# Altium schematic sheet Sheet1.SchDoc
size A
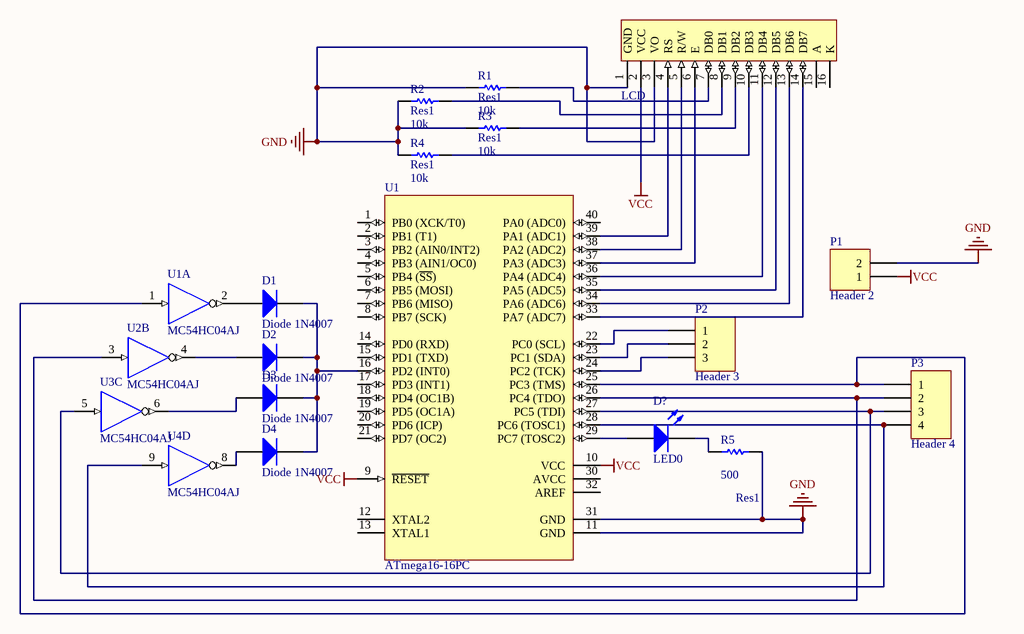
[diagram p0: Sheet1.SchDoc]

## Parts
(Parts that share a designator on the sheet are numbered #1, #2 ... from top to bottom, then left to right.)
D1  Diode 1N4007  [DO-41]
D2  Diode 1N4007  [DO-41]
D3  Diode 1N4007  [DO-41]
D4  Diode 1N4007  [DO-41]
D?  LED0  [LED-0]
LCD  LCD 16X2  [My_LCD 16x2-A]  (value not drawn)
P1  Header 2  [HDR1X2]
P2  Header 3  [HDR1X3]
P3  Header 4  [HDR1X4]
R1  Res1  value 10k  [AXIAL-0.3]
R2  Res1  value 10k  [AXIAL-0.3]
R3  Res1  value 10k  [AXIAL-0.3]
R4  Res1  value 10k  [AXIAL-0.3]
R5  Res1  value 500  [AXIAL-0.3]
U1#1  ATmega16-16PC  [40P6]
U1#2  MC54HC04AJ  [632-08]  (part A of 6)
U2  MC54HC04AJ  [632-08]  (part B of 6)
U3  MC54HC04AJ  [632-08]  (part C of 6)
U4  MC54HC04AJ  [632-08]  (part D of 6)

## Nets
GND: LCD.1(GND) LCD.3(VO) P1.2 R1.1 R2.1 R3.1 R4.1 R5.2 U1#1.11(GND) U1#1.31(GND) U1#2.7(GND) U2.7(GND) U3.7(GND) U4.7(GND)
VCC: LCD.2(VCC) P1.1 U1#1.9(~{RESET}) U1#1.10(VCC)
VDD: U1#2.14(VDD) U2.14(VDD) U3.14(VDD) U4.14(VDD)
NetD1_1: D1.1(A) U1#2.2(Y)
NetD1_2: D1.2(K) D2.2(K) D3.2(K) D4.2(K) U1#1.16(PD2_(INT0))
NetD2_1: D2.1(A) U2.4(Y)
NetD3_1: D3.1(A) U3.6(Y)
NetD4_1: D4.1(A) U4.8(Y)
NetD?_1: D?.1(A) U1#1.29(PC7_(TOSC2))
NetD?_2: D?.2(K) R5.1
NetLCD_4: LCD.4(RS) U1#1.39(PA1_(ADC1))
NetLCD_5: LCD.5(R/W) U1#1.38(PA2_(ADC2))
NetLCD_6: LCD.6(E) U1#1.37(PA3_(ADC3))
NetLCD_7: LCD.7(DB0) R1.2
NetLCD_8: LCD.8(DB1) R2.2
NetLCD_9: LCD.9(DB2) R3.2
NetLCD_10: LCD.10(DB3) R4.2
NetLCD_11: LCD.11(DB4) U1#1.36(PA4_(ADC4))
NetLCD_12: LCD.12(DB5) U1#1.35(PA5_(ADC5))
NetLCD_13: LCD.13(DB6) U1#1.34(PA6_(ADC6))
NetLCD_14: LCD.14(DB7) U1#1.33(PA7_(ADC7))
NetP2_1: P2.1 U1#1.22(PC0_(SCL))
NetP2_2: P2.2 U1#1.23(PC1_(SDA))
NetP2_3: P2.3 U1#1.24(PC2_(TCK))
NetP3_1: P3.1 U1#1.25(PC3_(TMS)) U1#2.1(A)
NetP3_2: P3.2 U1#1.26(PC4_(TDO)) U2.3(A)
NetP3_3: P3.3 U1#1.27(PC5_(TDI)) U3.5(A)
NetP3_4: P3.4 U1#1.28(PC6_(TOSC1)) U4.9(A)

Not connected (* = marked no-connect by the designer): LCD 15(A) 16(K); U1#1 1(PB0_(XCK/T0)) 2(PB1_(T1)) 3(PB2_(AIN0/INT2)) 4(PB3_(AIN1/OC0)) 5(PB4_(~{SS})) 6(PB5_(MOSI)) 7(PB6_(MISO)) 8(PB7_(SCK)) 12(XTAL2) 13(XTAL1) 14(PD0_(RXD)) 15(PD1_(TXD)) 17(PD3_(INT1)) 18(PD4_(OC1B)) 19(PD5_(OC1A)) 20(PD6_(ICP)) 21(PD7_(OC2)) 30(AVCC) 32(AREF) 40(PA0_(ADC0))

## Library data of the parts
D1-D4 = Diode 1N4007: 1 Amp General Purpose Rectifier; Published: 8-Jun-2000; LatestRevisionDate: 17-Jul-2002; LatestRevisionNote: Re-released for DXP Platform.; DatasheetVersion: 1998; PackageVersion: Aug-1999; PackageReference: DO-41; Publisher: Altium Limited; PackageDescription: Diode, Axial; Body 5.2 x 2.7 mm (LxDia. max), Lead Dia. 0.86 mm (max); Code_JEDEC: DO-204-AL; ComponentLink1Description: Manufacturer Link; ComponentLink1URL: http://www.fairchildsemi.com/; ComponentLink2Description: Datasheet; ComponentLink2URL: http://www.fairchildsemi.com/ds/1N%2F1N4001.pdf
D? = LED0: Typical INFRARED GaAs LED; Published: 8-Jun-2000; LatestRevisionDate: 08-Jul-2005; LatestRevisionNote: Mech Layer 1 removed.; PackageReference: LED-0; Publisher: Altium Limited; PackageDescription: LED; 2 Leads
LCD = LCD 16X2: LCD 16X2 Character lcd
P1 = Header 2: Header, 2-Pin; LatestRevisionDate: 17-Jul-2002; LatestRevisionNote: Re-released for DXP Platform.; Publisher: Altium Limited
P2 = Header 3: Header, 3-Pin; LatestRevisionDate: 17-Jul-2002; LatestRevisionNote: Re-released for DXP Platform.; Publisher: Altium Limited
P3 = Header 4: Header, 4-Pin; LatestRevisionDate: 17-Jul-2002; LatestRevisionNote: Re-released for DXP Platform.; Publisher: Altium Limited
R1-R5 = Res1: Resistor; Published: 8-Jun-2000; LatestRevisionDate: 17-Jul-2002; LatestRevisionNote: Re-released for DXP Platform.; PackageReference: AXIAL-0.3; Publisher: Altium Limited; PackageDescription: Axial Device, Thru-Hole; 2 Leads; 0.3 in Pin Spacing
U1#1 = ATmega16-16PC: 8-Bit AVR Microcontroller with 16K Bytes of In-System Programmable Flash Memory; Published: 17-Sep-2003; DatasheetVersion: 2466E-AVR-10/02; PackageVersion: revB, Sep-2001; PackageReference: 40P6; Publisher: Altium Limited; PackageDescription: 40-lead (0.600"/15.24mm Wide) Plastic Dual Inline Package (PDIP); Supplier 1: Digi-Key; Supplier Part Number 1: ATMEGA16-16PC-ND; Supplier 2: Mouser; Supplier Part Number 2: 556-ATMEGA16-16PC; Code_JEDEC: MS-011-AC; ComponentLink1Description: Datasheet; ComponentLink1URL: http://www.atmel.com/dyn/resources/prod_documents/doc2466.pdf; ComponentLink2Description: Atmel.com Home; ComponentLink2URL: http://www.atmel.com
U1#2 U2-U4 = MC54HC04AJ: Hex Inverter; Published: 17-Jul-2002; LatestRevisionDate: 06-Jun-2005; LatestRevisionNote: Stylized 3D Model Added; DatasheetVersion: 1989; PackageReference: 632-08; Publisher: Altium Limited; PackageDescription: DIP; 14 Leads; Row Spacing 7.62 mm; Pitch 2.54 mm; ComponentLink1Description: Manufacturer Link; ComponentLink1URL: http://www.onsemi.com/site/products/parametrics/0,4446,247,00.html; ComponentLink2Description: Ibis Model; ComponentLink2URL: http://www.onsemi.com/pub/Collateral/MC54HC04AJ.IBS